# EAGLE design DifferentialSPIEncoderMaster (EAGLE 9.6.2)
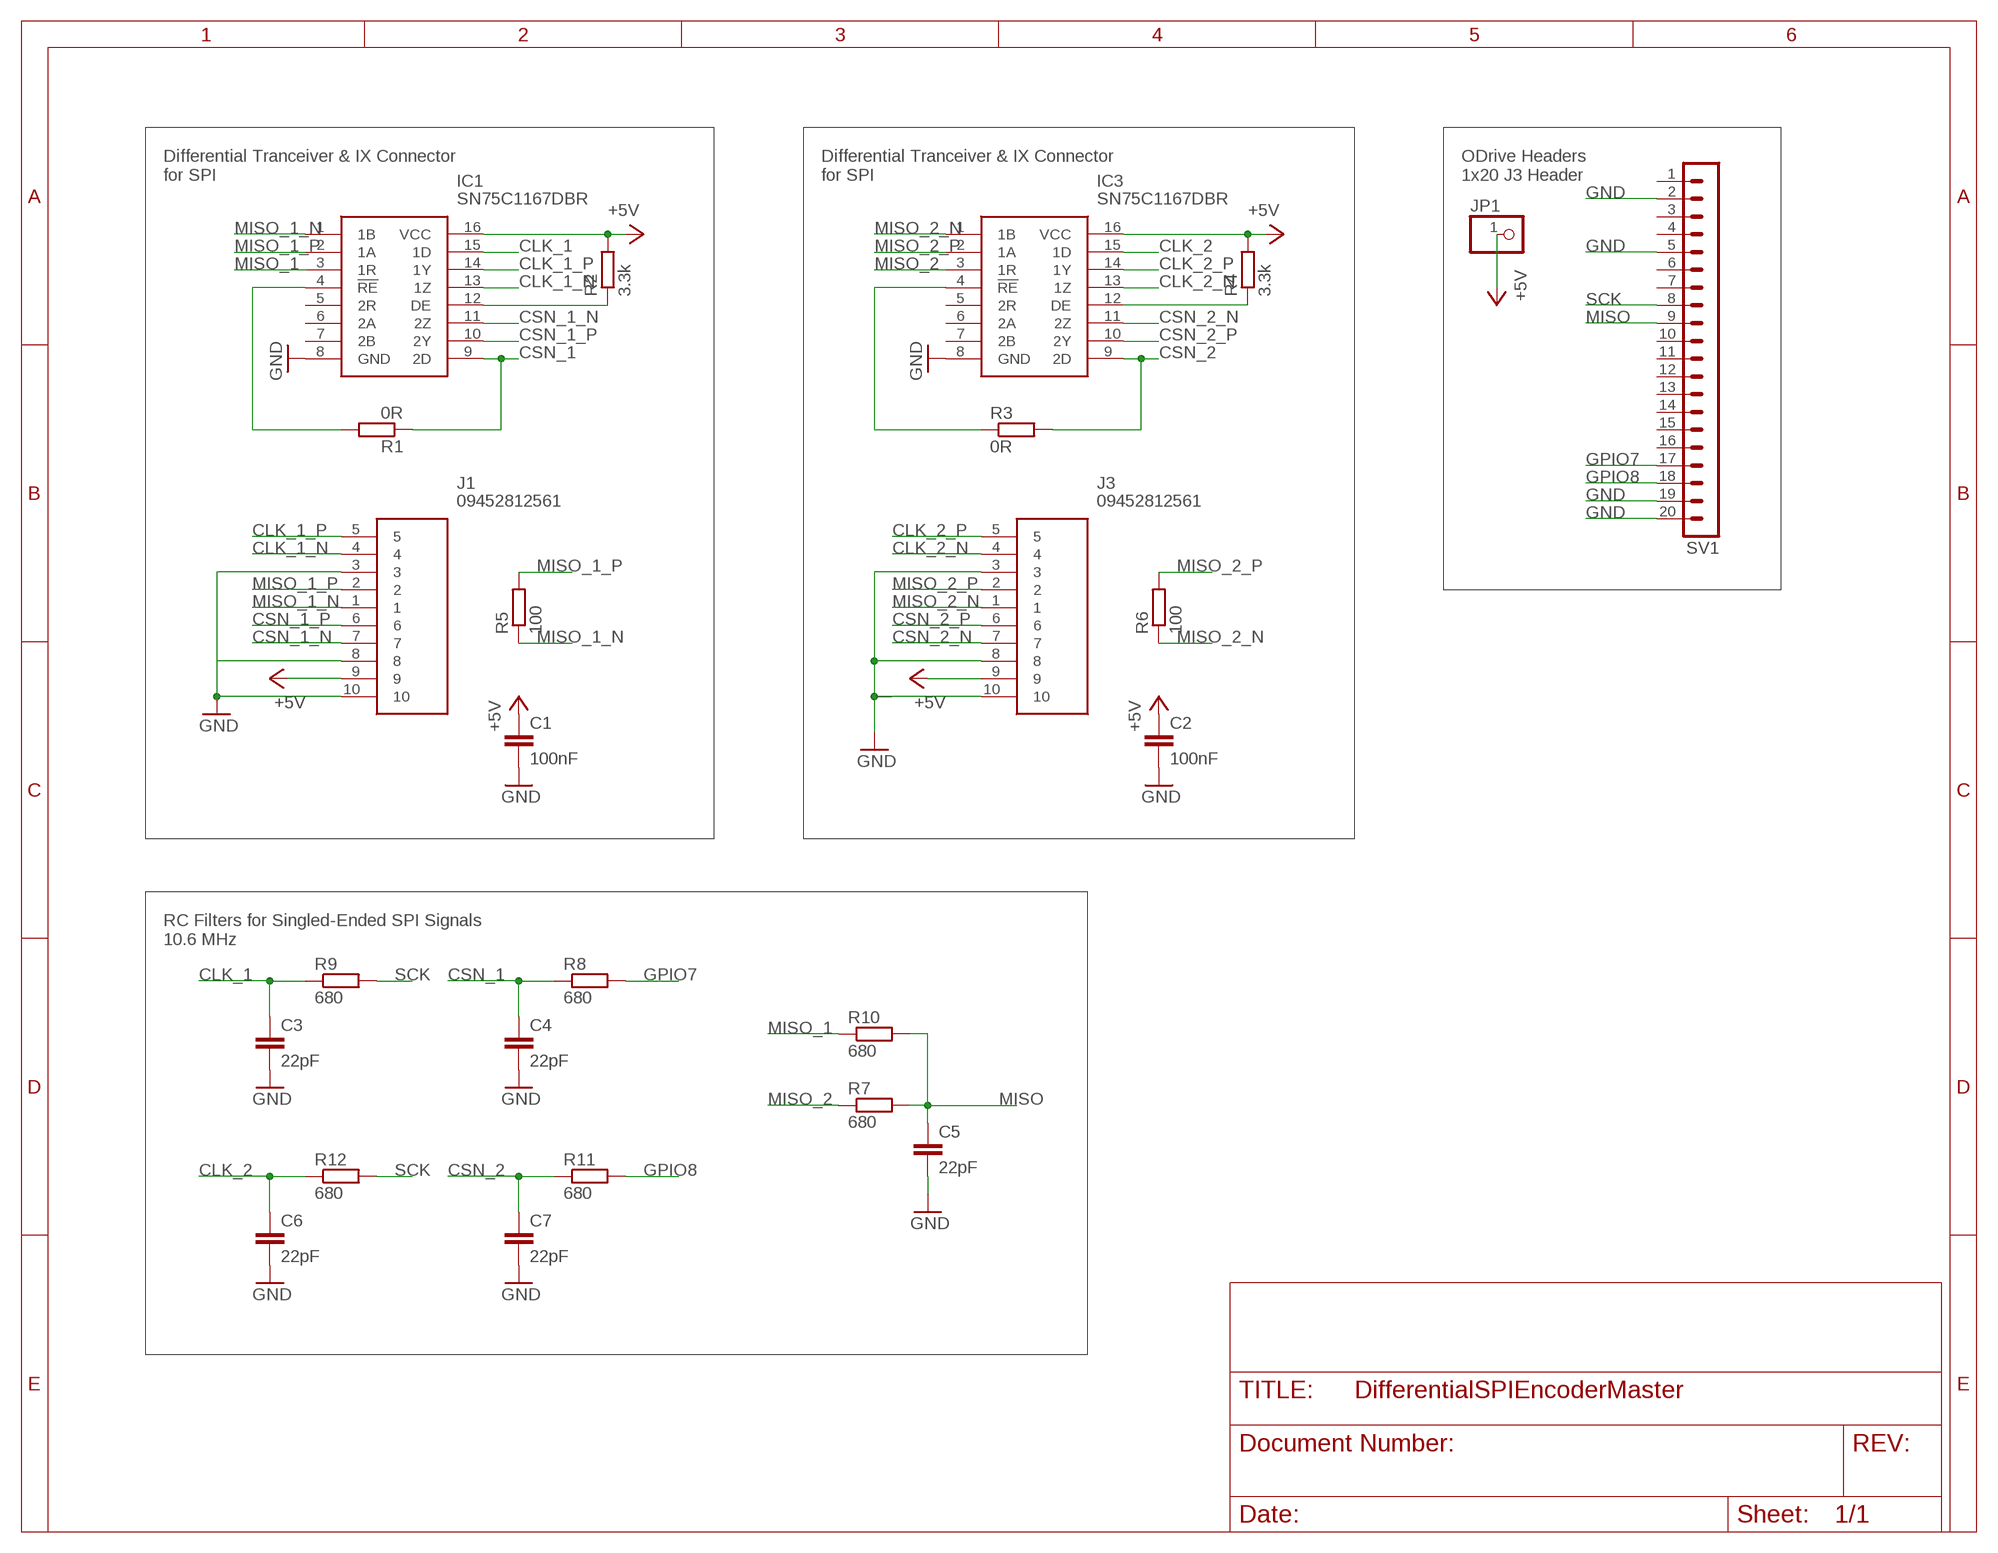
[diagram p0: schematic, sheet 1]

## Parts
C1  100nF  C-EUC0603  [C0603]
C2  100nF  C-EUC0603  [C0603]
C3  22pF  C-EUC0603  [C0603]
C4  22pF  C-EUC0603  [C0603]
C5  22pF  C-EUC0603  [C0603]
C6  22pF  C-EUC0603  [C0603]
C7  22pF  C-EUC0603  [C0603]
IC1  SN75C1167DBR  [SOP65P780X200-16N]
IC3  SN75C1167DBR  [SOP65P780X200-16N]
J1  09452812561  [09452812561]
J3  09452812561  [09452812561]
JP1  PINHD-1X1  [1X01]
R1  0R  R-EU_R0603  [R0603]
R2  3.3k  R-EU_R0603  [R0603]
R3  0R  R-EU_R0603  [R0603]
R4  3.3k  R-EU_R0603  [R0603]
R5  100  R-EU_R0603  [R0603]
R6  100  R-EU_R0603  [R0603]
R7  680  R-EU_R0603  [R0603]
R8  680  R-EU_R0603  [R0603]
R9  680  R-EU_R0603  [R0603]
R10  680  R-EU_R0603  [R0603]
R11  680  R-EU_R0603  [R0603]
R12  680  R-EU_R0603  [R0603]
SV1  MA20-1  [MA20-1]

## Nets
+5V [power]: C1.1 C2.1 IC1.16(VCC) IC3.16(VCC) J1.9 J3.9 JP1.1 R2.2 R4.2
CLK_1: C3.1 IC1.15(1D) R9.1
CLK_1_N [diff_pairs]: IC1.13(1Z) J1.4
CLK_1_P [diff_pairs]: IC1.14(1Y) J1.5
CLK_2: C6.1 IC3.15(1D) R12.1
CLK_2_N [diff_pairs]: IC3.13(1Z) J3.4
CLK_2_P [diff_pairs]: IC3.14(1Y) J3.5
CSN_1: C4.1 IC1.4(!RE) IC1.9(2D) R1.1 R1.2 R8.1
CSN_1_N [diff_pairs]: IC1.11(2Z) J1.7
CSN_1_P [diff_pairs]: IC1.10(2Y) J1.6
CSN_2: C7.1 IC3.4(!RE) IC3.9(2D) R3.1 R3.2 R11.1
CSN_2_N [diff_pairs]: IC3.11(2Z) J3.7
CSN_2_P [diff_pairs]: IC3.10(2Y) J3.6
GND [GND]: C1.2 C2.2 C3.2 C4.2 C5.2 C6.2 C7.2 IC1.8(GND) IC3.8(GND) J1.3 J1.8 J1.10 J3.3 J3.8 J3.10 SV1.2 SV1.5 SV1.19 SV1.20
GPIO7: R8.2 SV1.17
GPIO8: R11.2 SV1.18
MISO: C5.1 R7.2 R10.2 SV1.9
MISO_1: IC1.3(1R) R10.1
MISO_1_N [diff_pairs]: IC1.1(1B) J1.1 R5.1
MISO_1_P [diff_pairs]: IC1.2(1A) J1.2 R5.2
MISO_2: IC3.3(1R) R7.1
MISO_2_N [diff_pairs]: IC3.1(1B) J3.1 R6.1
MISO_2_P [diff_pairs]: IC3.2(1A) J3.2 R6.2
N$2: IC1.12(DE) R2.1
N$4: IC3.12(DE) R4.1
SCK: R9.2 R12.2 SV1.8
Unconnected: IC1.5(2R) IC1.6(2A) IC1.7(2B) IC3.5(2R) IC3.6(2A) IC3.7(2B) SV1.1 SV1.3 SV1.4 SV1.6 SV1.7 SV1.10 SV1.11 SV1.12 SV1.13 SV1.14 SV1.15 SV1.16

## Notes on the sheet
- Differential Tranceiver & IX Connector
  for SPI
- Differential Tranceiver & IX Connector
  for SPI
- ODrive Headers
  1x20 J3 Header
- RC Filters for Singled-Ended SPI Signals
  10.6 MHz

## Library data of the parts
C1-C7 = rcl:C-EU: CAPACITOR, European symbol; SPICEPREFIX: C
IC1 IC3 = SamacSys_Parts:SN75C1167DBR: Dual Differential Drivers And Receivers Source: Datasheet <http://www.ti.com/lit/ds/symlink/sn65c1168.pdf>; ARROW_PART_NUMBER: SN75C1167DBR; ARROW_PRICE-STOCK: https://www.arrow.com/en/products/sn75c1167dbr/texas-instruments; DESCRIPTION: Dual Differential Drivers And Receivers; HEIGHT: 2mm; MANUFACTURER_NAME: Texas Instruments; MANUFACTURER_PART_NUMBER: SN75C1167DBR; MOUSER_PART_NUMBER: 595-SN75C1167DBR; MOUSER_PRICE-STOCK: https://www.mouser.co.uk/ProductDetail/Texas-Instruments/SN75C1167DBR?qs=pt%2FIv5r0EPcWpN7RZQ7l7A%3D%3D
J1 J3 = SamacSys_Parts:09452812561: Headers & Wire Housings ix Industrial 10A-1 jack V T&R450 Source: Datasheet <https://b2b.harting.com/files/download/PRD/PDF_TS/09452812561_100805702DRW000C.pdf>; ARROW_PART_NUMBER: 09452812561; ARROW_PRICE-STOCK: https://www.arrow.com/en/products/09452812561/harting; DESCRIPTION: Headers & Wire Housings ix Industrial 10A-1 jack V T&R450; HEIGHT: mm; MANUFACTURER_NAME: HARTING; MANUFACTURER_PART_NUMBER: 09452812561; MOUSER_PART_NUMBER: 617-09452812561; MOUSER_PRICE-STOCK: https://www.mouser.co.uk/ProductDetail/HARTING/09452812561?qs=T3oQrply3y9RXFJZyDv9Rw%3D%3D
JP1 = pinhead:PINHD-1X1: PIN HEADER
R1-R12 = rcl:R-EU_: RESISTOR, European symbol; SPICEPREFIX: R
SV1 = con-lstb:MA20-1: PIN HEADER; OC_FARNELL: unknown; OC_NEWARK: unknown

## Net classes
1 diff_pairs: width 0.254 mm, clearance 0.152 mm
2 power: width 0.305 mm
3 GND: width 0.305 mm

## Board
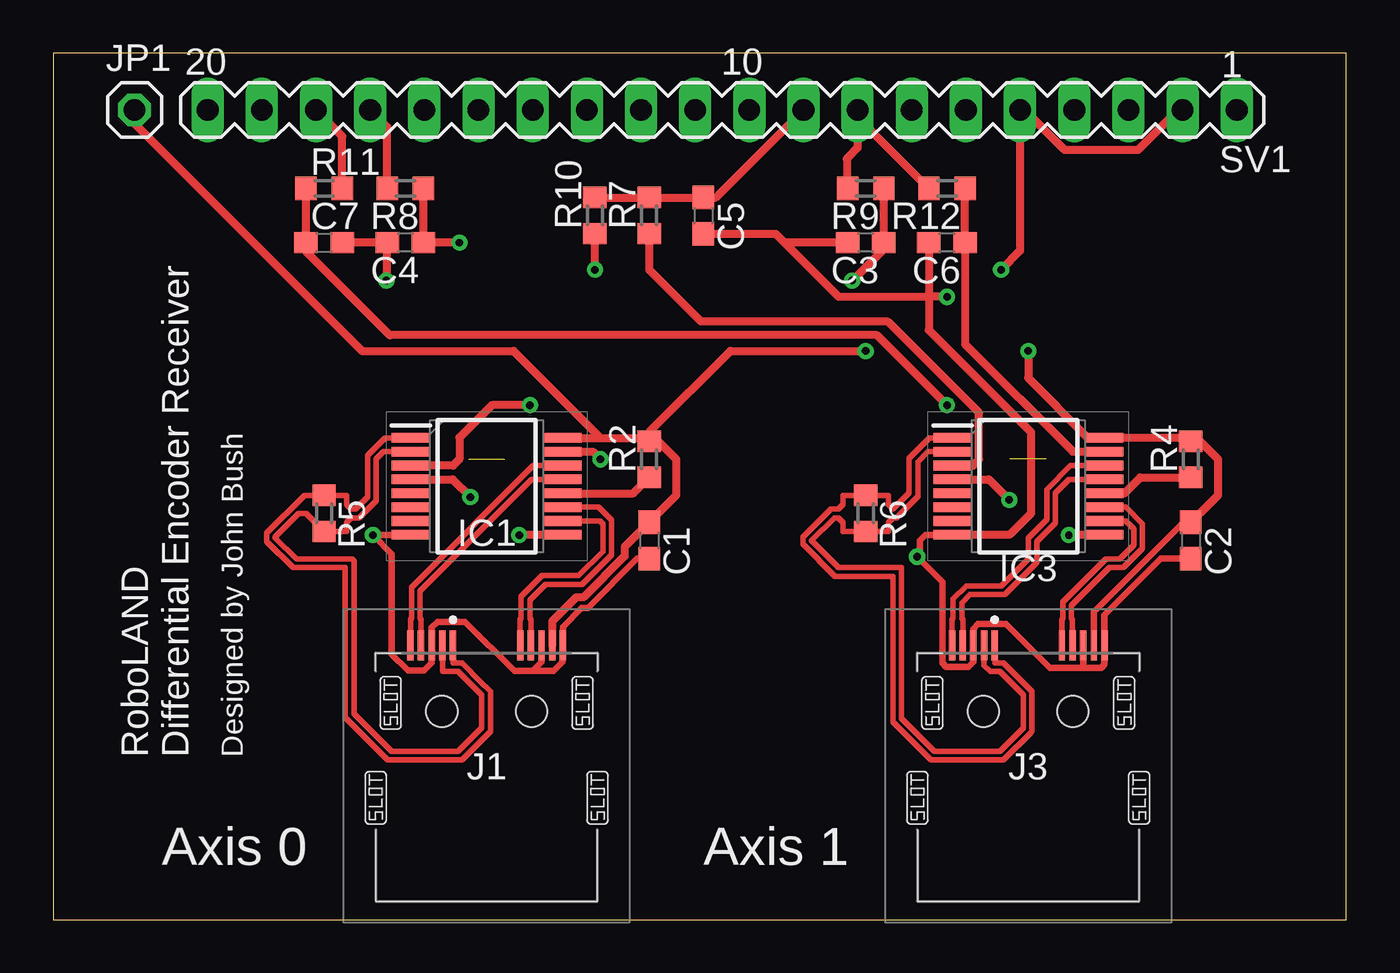
[diagram p1: board, top side]
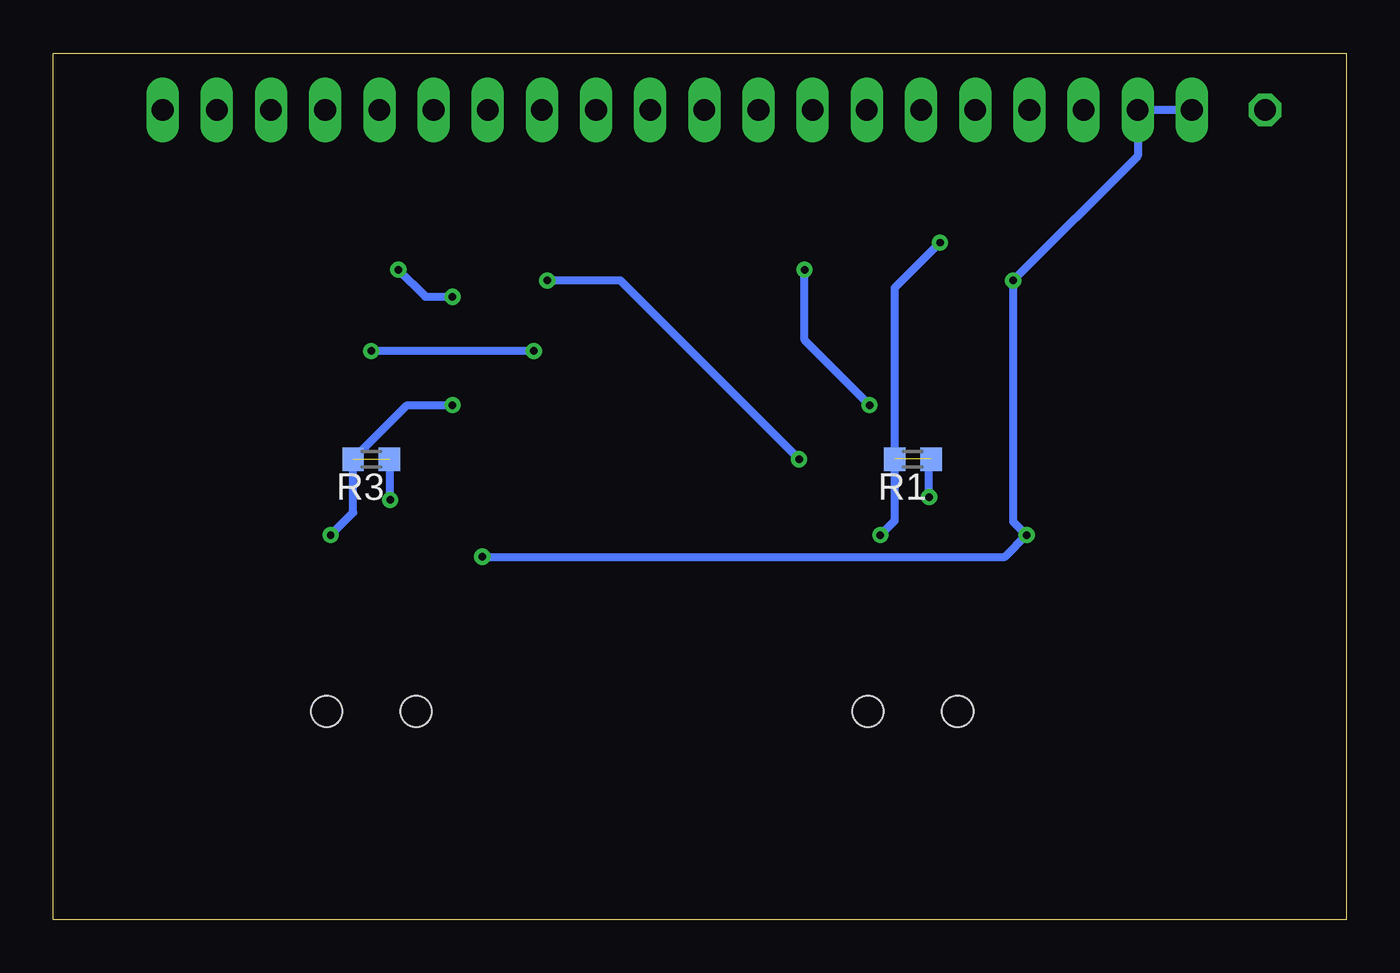
[diagram p2: board, bottom side, seen from below]

Size 60.63 x 40.63 mm. Coordinates in mm from the lower left corner, seen from the top.
Outline: 0,0 60.63,0 60.63,40.63 0,40.63 0,0
Copper layers (1*16): Top 0.035mm / dielectric 1.5mm / Bottom 0.035mm
Design rules "default": minimum track width 6mil, minimum drill 0.35mm, track to track 6mil, track to pad 6mil, pad to pad 6mil, via to via 6mil, smd to smd 6mil, copper to edge 40mil, drill to drill 6mil, minimum pad ring 10mil, minimum via ring 8mil, stop-mask expansion 4mil, vias tented up to drill 0mil, thermal gap 10mil

### Footprints (pad centres in the part's own frame; a part is rotated, then mirrored left to right if it is on the bottom)
C0603 = smd 1.1 x 1: 1 -0.85,0; 2 0.85,0
SOP65P780X200-16N = smd 1.8 x 0.45: 1 -3.55,2.275; 2 -3.55,1.625; 3 -3.55,0.975; 4 -3.55,0.325; 5 -3.55,-0.325; 6 -3.55,-0.975; 7 -3.55,-1.625; 8 -3.55,-2.275; 9 3.55,-2.275; 10 3.55,-1.625; 11 3.55,-0.975; 12 3.55,-0.325; 13 3.55,0.325; 14 3.55,0.975; 15 3.55,1.625; 16 3.55,2.275
09452812561 = smd 0.3 x 1.4: 1 -1.575,2.7; 2 -2.075,2.7; 3 -2.575,2.7; 4 -3.075,2.7; 5 -3.575,2.7; 6 1.575,2.7; 7 2.075,2.7; 8 2.575,2.7; 9 3.075,2.7; 10 3.575,2.7 | hole 1.45: -2.1,-0.4; 2.1,-0.4
1X01 = drill 1.016 octagon: 1 0,0
R0603 = smd 1 x 1.1: 1 -0.85,0; 2 0.85,0
MA20-1 = drill 1.016 long: 1 -24.13,0; 2 -21.59,0; 3 -19.05,0; 4 -16.51,0; 5 -13.97,0; 6 -11.43,0; 7 -8.89,0; 8 -6.35,0; 9 -3.81,0; 10 -1.27,0; 11 1.27,0; 12 3.81,0; 13 6.35,0; 14 8.89,0; 15 11.43,0; 16 13.97,0; 17 16.51,0; 18 19.05,0; 19 21.59,0; 20 24.13,0

### Placement (x,y rotation side)
C1  27.94,17.78 270 top
C2  53.34,17.78 270 top
C3  38.1,31.75 180 top
C4  16.51,31.75 180 top
C5  30.48,33.02 270 top
C6  41.91,31.75 180 top
C7  12.7,31.75 0 top
IC1  20.32,20.32 0 top
IC3  45.72,20.32 0 top
J1  20.32,10.16 0 top
J3  45.72,10.16 0 top
JP1  3.81,37.97 0 top
R1  20.32,21.59 180 bottom
R2  27.94,21.59 90 top
R3  45.72,21.59 180 bottom
R4  53.34,21.59 90 top
R5  12.7,19.05 270 top
R6  38.1,19.05 270 top
R7  27.94,33.02 90 top
R8  16.51,34.29 180 top
R9  38.1,34.29 180 top
R10  25.4,33.02 90 top
R11  12.7,34.29 0 top
R12  41.91,34.29 180 top
SV1  31.37,37.97 180 top

### Tracks (layer width: path | path; a pad name or v marks a point on that pad's centre or on a via)
+5V  (via drill 0.35)
  Top 0.305: J3.9 48.8,14.43 53,18.63 C2.1
  Top 0.381: IC1.16 25.66,22.59 | 25.66,22.59 27.79,22.59 R2.2 | JP1.1 3.81,37.34 14.48,26.67 21.59,26.67 25.66,22.59 | J1.9 23.39,13.99 24.52,15.11 24.86,15.11 26.8,17.05 26.8,17.49 C1.1 29.21,19.9 29.21,21.59 28.36,22.44 R2.2 | C2.1 54.61,19.9 54.61,21.59 53.76,22.44 R4.2 53.19,22.59 IC3.16 48.52,22.59 45.72,25.4 v45.72,26.67 | R2.2 27.94,22.86 31.75,26.67 v38.1,26.67
  Bottom 0.381: v38.1,26.67 v45.72,26.67
CLK_1  (via drill 0.35)
  Top 0.381: R9.1 C3.1 38.95,31.46 v37.47,29.97 | IC1.15 25.3,21.95 v25.65,21.59
  Bottom 0.381: v25.65,21.59 34.04,29.97 v37.47,29.97
CLK_1_N
  Top 0.254: J1.4 17.25,14.07 17.2,14.12 17.2,15.42 22.42,20.64 IC1.13
CLK_1_P
  Top 0.254: J1.5 16.75,14.07 16.79,14.12 16.79,15.59 22.5,21.3 IC1.14
CLK_2
  Top 0.381: R12.1 C6.1 42.76,26.99 47.8,21.95 IC3.15
CLK_2_N
  Top 0.254: J3.4 42.65,14.07 42.6,14.12 42.6,14.86 42.98,15.24 44.62,15.24 46.13,16.75 46.13,17.74 46.99,18.6 46.99,20 47.63,20.64 IC3.13
CLK_2_P
  Top 0.254: J3.5 42.15,14.07 42.19,14.12 42.19,15.03 42.81,15.65 44.45,15.65 45.72,16.92 45.72,17.91 46.58,18.77 46.58,20.17 47.7,21.3 IC3.14
CSN_1  (via drill 0.35)  (1 unrouted)
  Top 0.381: IC1.9 21.86,18.05 v21.84,18.03 | IC1.4 18.73,20.64 v19.56,19.81 | v19.05,31.75 C4.1 R8.1
  Bottom 0.381: v19.56,19.81 19.56,21.5 R1.1 | R1.2 21.21,21.55 | R1.2 21.17,29.63 v19.05,31.75 | v21.84,18.03 21.17,18.71 R1.2
CSN_1_N
  Top 0.254: J1.7 22.39,14.07 22.35,14.12 22.35,14.99 23.09,15.72 24.81,15.72 26.19,17.1 26.19,18.73 25.57,19.34 IC1.11
CSN_1_P
  Top 0.254: J1.6 21.89,14.07 21.94,14.12 21.94,15.15 22.92,16.13 24.64,16.13 25.78,17.27 25.78,18.56 25.65,18.7 IC1.10
CSN_2  (via drill 0.35)  (1 unrouted)
  Top 0.381: R11.1 C7.1 11.85,31.33 15.77,27.41 38.63,27.41 v41.91,24.13 | IC3.4 43.87,20.64 v44.83,19.68 | IC3.9 47.64,18.05 v47.62,18.03
  Bottom 0.381: v44.83,19.68 44.83,21.55 R3.1 | v47.62,18.03 46.57,19.09 R3.2 44.03,24.13 v41.91,24.13
CSN_2_N
  Top 0.254: J3.7 47.8,14.07 47.75,14.12 47.75,14.73 49.53,16.51 50.19,16.51 51.08,17.4 51.08,18.56 50.3,19.34 IC3.11
CSN_2_P
  Top 0.254: J3.6 47.3,14.07 47.34,14.12 47.34,14.9 49.36,16.92 50.02,16.92 50.67,17.57 50.67,18.32 50.3,18.7 IC3.10
GND  (via drill 0.35)
  Top 0.305: 22.47,11.65 22.89,12.08 J1.8 | 22.47,11.65 21.62,11.65 19.3,13.97 18.02,13.97 17.75,13.7 J1.3 17.75,12.03 17.4,11.68 16.64,11.68 15.88,12.45 15.88,17.14 v14.99,18.03 16.76,18.03 | C2.2 51.94,16.93 49.3,14.28 J3.10 49.3,11.96 49.15,11.81 48.26,11.81 | 22.47,11.65 23.47,11.65 23.89,12.07 J1.10 23.89,13.73 24.78,14.62 25.07,14.62 27.38,16.93 C1.2 | 48.26,11.81 46.74,11.81 44.68,13.87 43.37,13.87 43.15,13.64 J3.3 43.15,12.08 42.92,11.86 41.87,11.86 41.69,12.03 41.69,15.84 v40.51,17.02 40.64,17.14 40.64,17.78 40.91,18.05 IC3.8 | J3.8 48.3,11.85 48.26,11.81
  Top 0.381: C5.2 33.87,32.17 34.29,31.75 | C3.2 34.29,31.75 | v15.62,29.97 15.62,31.71 C4.2 C7.2 | 16.76,18.03 IC1.8 | C6.2 41.06,29.21 | 41.06,29.21 41.06,27.65 45.85,22.86 45.85,19.05 44.84,18.05 IC3.8 | SV1.2 52.74,37.97 50.88,36.11 47.42,36.11 45.55,37.97 SV1.5 45.34,31.37 v44.45,30.48 | 34.29,31.75 36.83,29.21 41.06,29.21 | v41.91,29.21 41.06,29.21
  Bottom 0.381: SV1.20 SV1.19 9.78,35.81 v15.62,29.97 15.62,18.67 v14.99,18.03 16,17.02 v40.51,17.02 | v44.45,30.48 43.18,29.21 v41.91,29.21
GPIO7
  Top 0.381: R8.2 15.66,37.17 SV1.17
GPIO8
  Top 0.381: R11.2 13.55,36.74 SV1.18
MISO
  Top 0.381: R10.2 R7.2 C5.1 31.08,33.87 SV1.9
MISO_1  (via drill 0.35)
  Top 0.381: v22.35,24.13 20.57,24.13 19.05,22.61 19.05,21.59 18.75,21.3 IC1.3 | v25.4,30.48 R10.1
  Bottom 0.381: v22.35,24.13 25.4,27.18 v25.4,30.48
MISO_1_N
  Top 0.254: J1.1 18.75,12.03 19.16,12.03 20.04,11.15 20.49,10.7 20.49,10.16 20.49,8.82 19.16,7.49 15.69,7.49 13.69,9.48 13.69,16.51 11.24,16.51 10.01,17.74 10.01,18.12 11.78,19.9 R5.1 13.76,19.9 13.76,19.46 13.97,19.25 14.17,19.25 14.73,19.81 14.73,21.76 15.57,22.59 IC1.1
MISO_1_P
  Top 0.254: J1.2 18.25,11.65 18.27,11.63 18.99,11.63 20.09,10.53 20.09,8.99 18.99,7.89 15.86,7.89 14.1,9.65 14.1,16.83 14.01,16.92 11.4,16.92 10.41,17.91 10.41,17.95 11.5,19.04 11.86,19.04 R5.2 13.76,18.2 13.76,18.64 13.97,18.85 14.34,18.85 15.14,19.64 15.14,21.59 15.49,21.95 IC1.2
MISO_2
  Top 0.381: R7.1 27.94,30.48 30.35,28.07 39.12,28.07 43.41,23.77 43.41,21.58 43.13,21.3 IC3.3
MISO_2_N
  Top 0.254: IC3.1 41.1,22.59 40.13,21.63 40.13,20.02 39.37,19.25 39.16,19.46 39.16,19.9 R6.1 37.04,19.9 37.04,19.46 36.83,19.25 36.46,19.25 35.15,17.95 35.15,17.61 36.66,16.1 39.37,16.1 39.37,9.27 41.15,7.49 44.56,7.49 45.84,8.77 45.89,8.82 45.89,10.7 44.56,12.03 44.15,12.03 J3.1
MISO_2_P
  Top 0.254: IC3.2 41.02,21.95 40.54,21.46 40.54,19.85 39.54,18.85 39.37,18.85 39.16,18.64 39.16,18.2 R6.2 37.04,18.2 37.04,18.64 36.83,18.85 36.63,18.85 35.56,17.78 36.83,16.51 39.78,16.51 39.78,9.44 41.32,7.89 44.39,7.89 45.49,8.99 45.49,10.53 44.39,11.63 43.94,11.63 43.65,11.93 J3.2
N$2
  Top 0.381: IC1.12 27.2,20 R2.1
N$4
  Top 0.381: R4.1 50.98,20.74 50.23,20 IC3.12
SCK
  Top 0.381: R12.2 37.72,37.63 SV1.8 37.72,36.2 37.21,35.69 37.21,34.33 R9.2

### Text on the board
tNames: RoboLAND / Differential Encoder Receiver | Designed by John Bush | Axis 0 | Axis 1